# Altium schematic sheet LED_INDICATOR.SchDoc
size A4; SheetNumber: 9; SheetTotal: 9
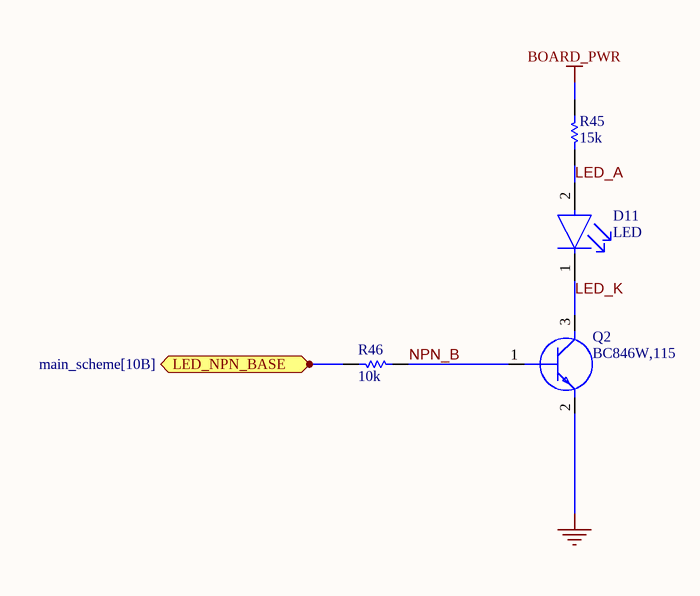
[diagram p0: LED_INDICATOR.SchDoc]

## Parts
D11  LED  [0603_RED_LED]
Q2  BC846W,115  [SOT65P210X110-3N]
R45  15k  [RESC1005X40X25NL05T05]
R46  10k  [RESC1005X40X25NL05T05]

## Ports
LED_NPN_BASE (bidir, see main_scheme[10B])

## Nets
BOARD_PWR: R45.2
GND: Q2.2(E)
LED_A: D11.2(A) R45.1
LED_K: D11.1(C) Q2.3(C)
LED_NPN_BASE: R46.2 ; port LED_NPN_BASE
NPN_B: Q2.1(B) R46.1

## Library data of the parts
D11 = 0603_RED_LED_2V2: LED RED DIFFUSED 1608 SMD; Manufacturer: Rohm; Manufacturer Part Number: SML-D12U1WT86; Led Orientation: Top View; Power Dissipation: 54mW; Forward Current: 20mA; Wavelength: 620nm; Reverse Voltage: 5V; Luminous Intensity: 63mcd; Forward Voltage: 2.2V; Mouser Description: SML-D12 Series Red 0603 Diffused 63 mcd 2.2 V Surface Mount LED; Temperature: -40°C to +85°C; Device Class L2: LEDs; Lead Free: Yes; Automotive: No; Octopart: https://octopart.com/sml-d12u1wt86-rohm-70850259; RoHS: TRUE; Colour: Red; Digikey Description: LED RED DIFFUSED 1608 SMD; Package: SML-D12; Device Class L1: Optoelectronics; Category: Diode; Temperature Range High: +85°C; Height: 0.65mm; ComponentLink2Description: Datasheet; Temperature Range Low: -40°C; ComponentLink2URL: https://www.rohm.com/datasheet/SML-D12U1W/sml-d12x1-e; Device Class L3: unset
Q2 = BC846W,115: Transistor BJT NPN; Manufacturer_Name: Nexperia; Datasheet Link: https://ms.componentsearchengine.com/Datasheets/2/BC846W,115.pdf; Height: 1.1mm; Manufacturer_Part_Number: BC846W,115; Mouser Part Number: 771-BC846W115; Mouser Price/Stock: https://www.mouser.co.uk/ProductDetail/Nexperia/BC846W115?qs=me8TqzrmIYU%2FFbiR%252B6UaKA%3D%3D; Arrow Part Number: BC846W,115; Arrow Price/Stock: https://www.arrow.com/en/products/bc846w115/nexperia?region=nac
R45 R46 = Resistor 0402 100mW: Part Number: ERJ2RKF6800X; Manufacturer: Panasonic